# Altium schematic sheet FOTA Burn Buffer.SchDoc: FOTA Burn Buffer
size 292 x 193 mm; DocumentNumber: 47; SheetNumber: 33; SheetTotal: 44
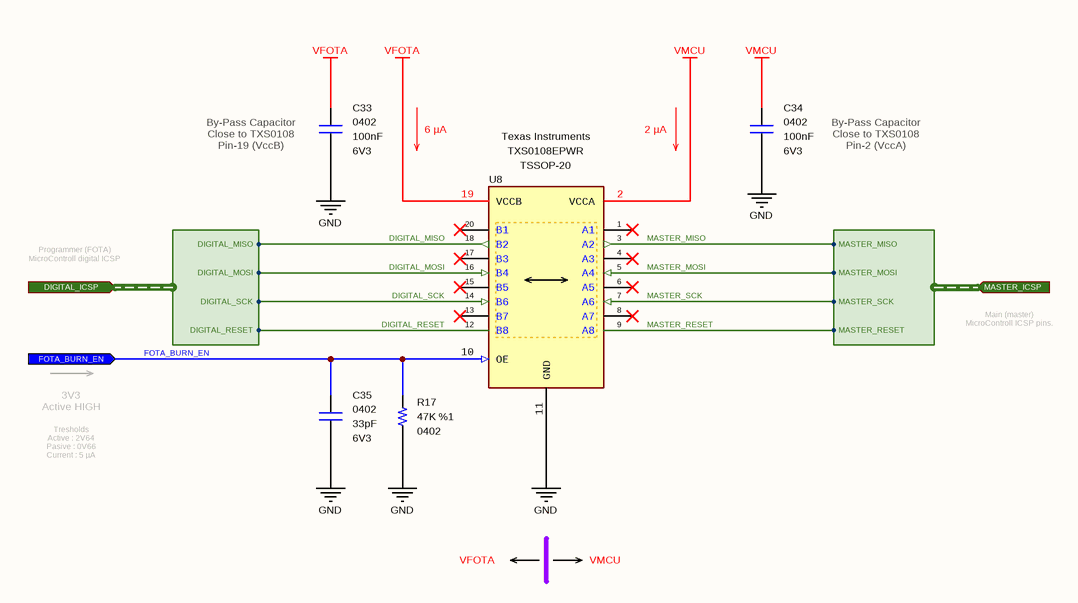
[diagram p0: FOTA Burn Buffer.SchDoc]

## Parts
C33  value 100nF  Case: 0402  Voltage: 6V3  [CAPACITOR_0402]  (hidden comment: Multilayer Ceramic Capacitor)
C34  value 100nF  Case: 0402  Voltage: 6V3  [CAPACITOR_0402]  (hidden comment: Multilayer Ceramic Capacitor)
C35  value 33pF  Case: 0402  Voltage: 6V3  [CAPACITOR_0402]  (hidden comment: Multilayer Ceramic Capacitor)
R17  value 47K  Tolerance: %1  Case: 0402  [RESISTOR_0402]  (hidden comment: 47K - 0402 - %1 - 1/16W)
U8  Manufacturer Part Number: TXS0108EPWR  Manufacturer Name: Texas Instruments  [TSSOP-20]  (hidden comment: Voltage Level Shifter)

## Ports
DIGITAL_ICSP (in, harness DIGITAL_ICSP), FOTA_BURN_EN (in), MASTER_ICSP (in, harness MASTER_ICSP)

## Harnesses
MASTER_ICSP: MASTER_MOSI, MASTER_MISO, MASTER_SCK, MASTER_RESET
DIGITAL_ICSP: DIGITAL_MOSI, DIGITAL_MISO, DIGITAL_SCK, DIGITAL_RESET

## Nets
GND: C33.1 C34.1 C35.2 R17.1 U8.11(GND)
VFOTA: C33.2 U8.19(VCCB)
VMCU: C34.2 U8.2(VCCA)
DIGITAL_MISO: U8.18(B2) ; port DIGITAL_ICSP.DIGITAL_MISO
DIGITAL_MOSI: U8.16(B4) ; port DIGITAL_ICSP.DIGITAL_MOSI
DIGITAL_RESET: U8.12(B8) ; port DIGITAL_ICSP.DIGITAL_RESET
DIGITAL_SCK: U8.14(B6) ; port DIGITAL_ICSP.DIGITAL_SCK
FOTA_BURN_EN: C35.1 R17.2 U8.10(OE) ; port FOTA_BURN_EN
MASTER_MISO: U8.3(A2) ; port MASTER_ICSP.MASTER_MISO
MASTER_MOSI: U8.5(A4) ; port MASTER_ICSP.MASTER_MOSI
MASTER_RESET: U8.9(A8) ; port MASTER_ICSP.MASTER_RESET
MASTER_SCK: U8.7(A6) ; port MASTER_ICSP.MASTER_SCK

Not connected (* = marked no-connect by the designer): U8 1(A1)* 4(A3)* 6(A5)* 8(A7)* 13(B7)* 15(B5)* 17(B3)* 20(B1)*

## Notes on the sheet
- (near C33) By-Pass Capacitor
  Close to TXS0108
  Pin-19 (VccB)
- 6 µA
- 2 µA
- By-Pass Capacitor
  Close to TXS0108
  Pin-2 (VccA)
- Programmer (FOTA) MicroControll digital ICSP pins.
- Main (master) MicroControll ICSP pins.
- 3V3
  Active HIGH
- Tresholds
  Active : 2V64
  Pasive : 0V66
  Current : 5 µA
- VFOTA
- VMCU
- © 2021 All rights reserved.
  This document may not, in whole or in part, be copied, photocopied, reproduced, translated or converted to any electronic or machine readable from without prior written permission of Mehmet Günce Akkoyun.
  Engineer contact : akkoyun@me.com
- Property of
- Engineer :
- Date :
- Size :
- A4
- Time :
- Project :
- Page :
- /
- Customer :
- Product ID :
- Module ID :
- Version :
- File :
- Revision :

## Library data of the parts
C33 C34 = Capacitor - 100nF [0402-6V3]: Capacitor - 100nF [0402-6V3] (Ceramic); Manufacturer Name: AVX; Manufacturer Part Number: 04026D104KAT4A; Dielectric: X5R; Tolerance: %10; Height: 0.25mm; ComponentLink1Description: Mouser; ComponentLink1URL: https://www.mouser.com.tr/ProductDetail/AVX/04026D104KAT4A?qs=sGAEpiMZZMs0AnBnWHyRQPg4iYkCw7IMED%2F4kpqgf7w%3D; ComponentLink2Description: DataSheet; ComponentLink2URL: https://www.mouser.com.tr/datasheet/2/40/cx5r-776519.pdf; ROHS: Yes; Maximum Operating Temperature: +85; Minimum Operating Temperature: -55; Supplier 1: Avnet; Supplier Part Number 1: 04026D104KAT4A; Mouser Part Number: 581-04026D104KAT4A
C35 = Capacitor - 33pF [0402-6V3]: Capacitor - 33pF [0402] (Ceramic); Manufacturer Name: Kemet; Manufacturer Part Number: C0402C330J9RACAUTO; Dielectric: X7R; Tolerance: 10%; Height: 0.5mm; Maximum Operating Temperature: +125; Minimum Operating Temperature: -55; ROHS: Yes; ComponentLink1Description: DataSheet; ComponentLink1URL: https://api.kemet.com/component-edge/download/datasheet/C0402C330J9RACAUTO.pdf; ComponentLink2Description: Mouser; ComponentLink2URL: https://www.mouser.com/Search/Refine.aspx?Keyword=80-C0402C330J9RAUTO; Supplier 1: Mouser; Supplier Part Number 1: 80-C0402C330J9RAUTO; Mouser Part Number: 80-C0402C330J9RAUTO
R17 = Resistor - 47K: Thick Film Resistors - SMD 1/16 W 47 Kohms 1%; Manufacturer Name: Vishay; Manufacturer Part Number: CRCW040247K0FKED; Height: 0.4mm; ComponentLink1Description: DataSheet; ComponentLink1URL: https://www.mouser.com.tr/datasheet/2/427/dcrcwe3-1762152.pdf; ComponentLink2Description: Mouser; ComponentLink2URL: https://www.mouser.com.tr/ProductDetail/Vishay-Dale/CRCW040247K0FKED?qs=sGAEpiMZZMu61qfTUdNhG2DpbjADlD3GL%252B3h1elTxqU%3D; Supplier 1: RSComponents; Supplier 2: Newark; Supplier Part Number 1: 6789361P; Supplier Part Number 2: 52K7097; Supplier 3: Avnet; Supplier 4: RSComponents; Supplier 5: Future Electronics; Supplier 6: Future Electronics; Supplier 7: Newark; Supplier 8: Arrow Electronics; Supplier 9: Mouser; Supplier 10: Newark; Supplier 11: Avnet; Supplier 12: Digi-Key; Supplier 13: Digi-Key; Supplier 14: Digi-Key; Supplier 15: Newark; Supplier 16: Farnell; Supplier 17: Farnell; Supplier 18: Farnell; Supplier 19: Allied Electronics; Supplier 20: Allied Electronics; Supplier 21: Avnet; Supplier 22: Future Electronics; Supplier 23: Future Electronics; Supplier 24: Future Electronics; Supplier 25: Newark; Supplier 26: RSComponents; Supplier 27: RSComponents; Supplier Part Number 3: 52K7097; Supplier Part Number 4: 6789361; Supplier Part Number 5: 2103738; Supplier Part Number 6: 7521222; Supplier Part Number 7: 42K3500; Supplier Part Number 8: CRCW040247K0FKED; Supplier Part Number 12: 541-47.0KLCT-ND; Supplier Part Number 14: 541-47.0KLTR-ND; Supplier Part Number 10: 61M5310; Supplier Part Number 9: 71-CRCW0402-47K-E3; Supplier Part Number 13: 541-47.0KLDKR-ND; Supplier Part Number 11: CRCW040247K0FKED; Supplier Part Number 15: 25AC7165; Supplier Part Number 16: 1469719; Supplier Part Number 18: 2121814; Supplier Part Number 17: 1469719RL; Supplier Part Number 19: 70202660; Supplier Part Number 20: 70272767; Supplier Part Number 21: 42K3500; Supplier Part Number 22: 6128776; Supplier Part Number 24: CRCW040247K0FKED-REEL; Supplier Part Number 23: CRCW040247K0FKED-CUTT; Supplier Part Number 25: 24W2315; Supplier Part Number 26: 1688455; Supplier Part Number 27: 1823505
U8 = IC - TXS0108EPW: Translation - Voltage Levels 8B Bidir Vltg-Level Translator; Supply Voltage - Max: 5.5V; Supply Voltage - Min: 1.2V; Height: 1.2mm; Mouser Part Number: 595-TXS0108EPWR; ComponentLink1Description: DataSheet; ComponentLink1URL: https://www.ti.com/lit/ds/symlink/txs0108e.pdf?HQS=dis-mous-null-mousermode-dsf-pf-null-wwe&ts=1609232216318&ref_url=https%253A%252F%252Fwww.mouser.com.tr%252F; Maximum Operating Temperature: +85; Minimum Operating Temperature: -40; ComponentLink2Description: Mouser; ComponentLink2URL: https://www.mouser.com.tr/ProductDetail/Texas-Instruments/TXS0108EPWR/?qs=IUbkBnfnSQLgiWtCbWtYOw%3D%3D; Supplier 2: Mouser; Supplier 3: Digi-Key; Supplier 4: Digi-Key; Supplier 5: Digi-Key; Supplier 6: Farnell; Supplier 7: Farnell; Supplier 8: Farnell; Supplier 9: RSComponents; Supplier 10: RSComponents; Supplier 1: Arrow Electronics; Supplier Part Number 1: TXS0108EPWR; Supplier Part Number 2: 595-TXS0108EPWR; Supplier Part Number 3: 296-23011-1-ND; Supplier Part Number 4: 296-23011-6-ND; Supplier Part Number 5: 296-23011-2-ND; Supplier Part Number 6: 1702548; Supplier Part Number 7: 1702548RL; Supplier Part Number 8: 2437921; Supplier Part Number 9: 7094639P; Supplier Part Number 10: 7094639; Case: TSSOP-20